# Altium schematic sheet ACH512识别升级仪V1.2_20260608.SchDoc
size A1; SheetNumber: 1; SheetTotal: 1
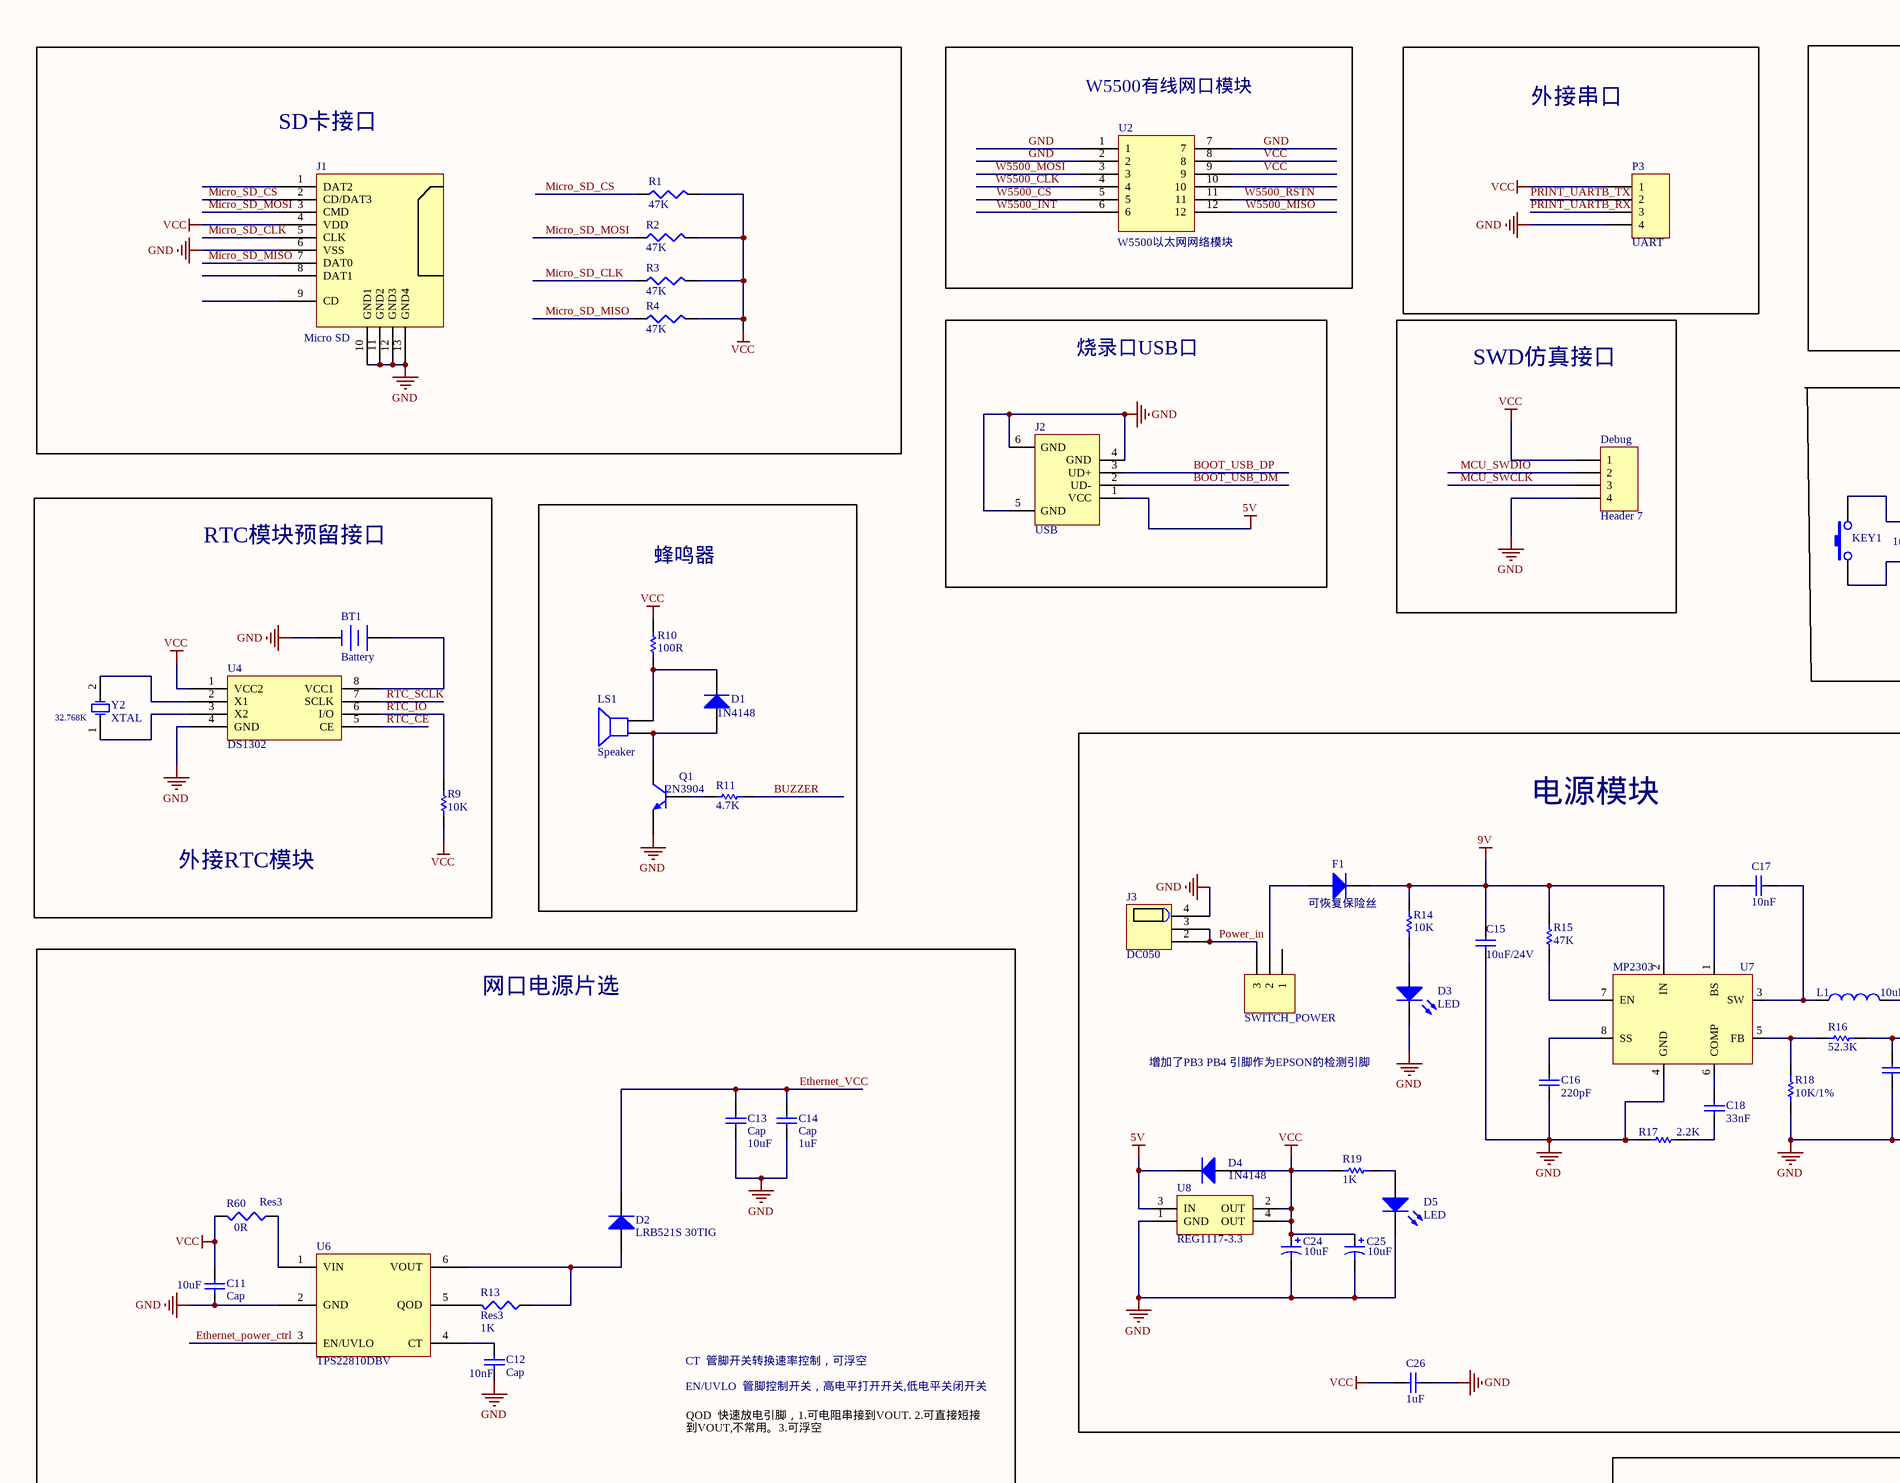
[diagram p0: ACH512识别升级仪V1.2_20260608.SchDoc, top left]
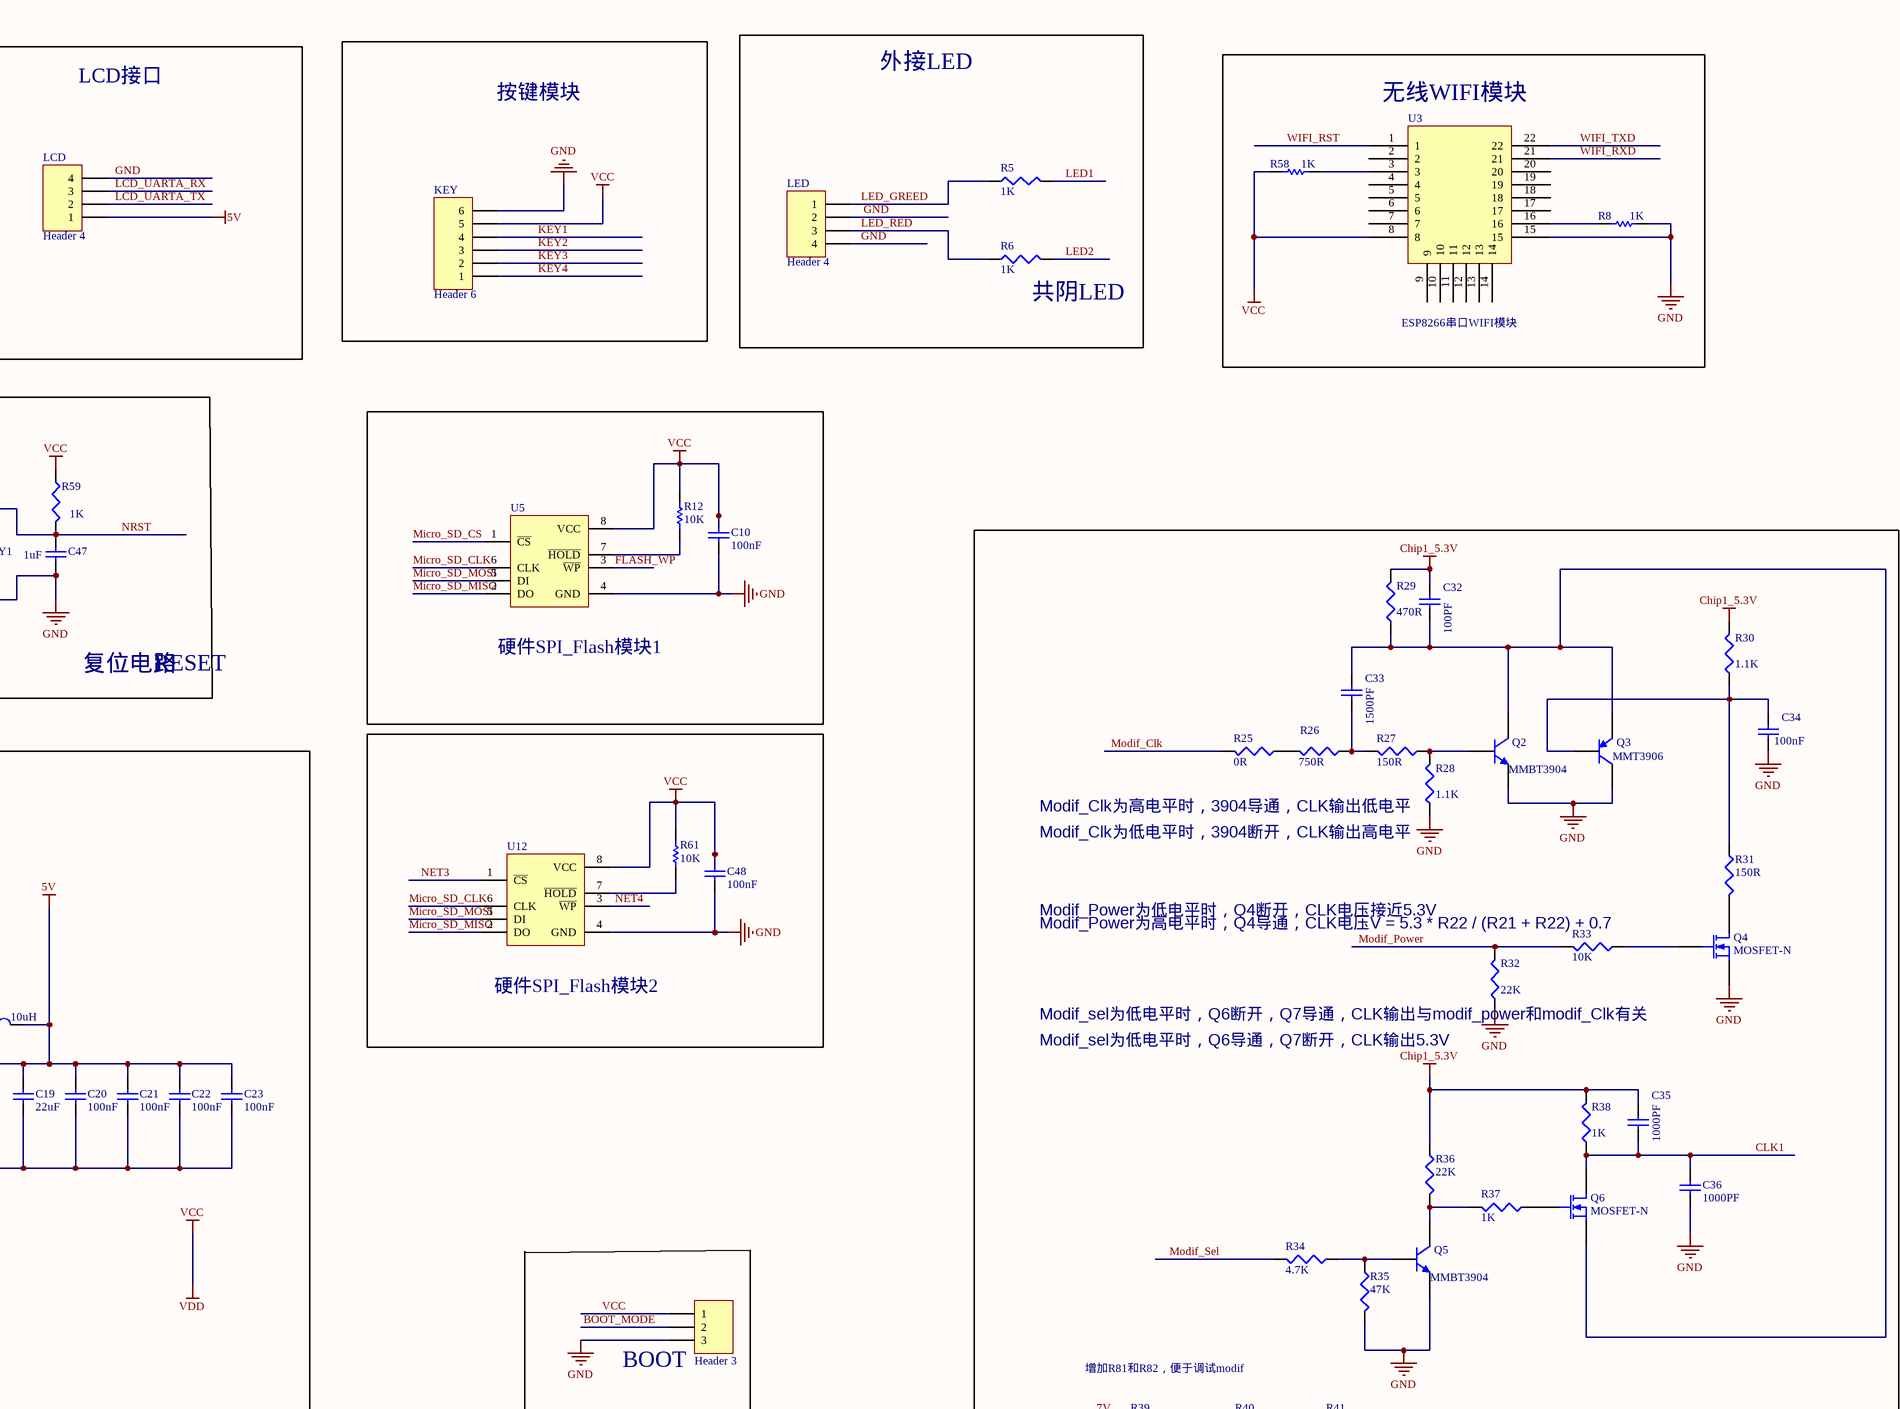
[diagram p1: ACH512识别升级仪V1.2_20260608.SchDoc, top right]
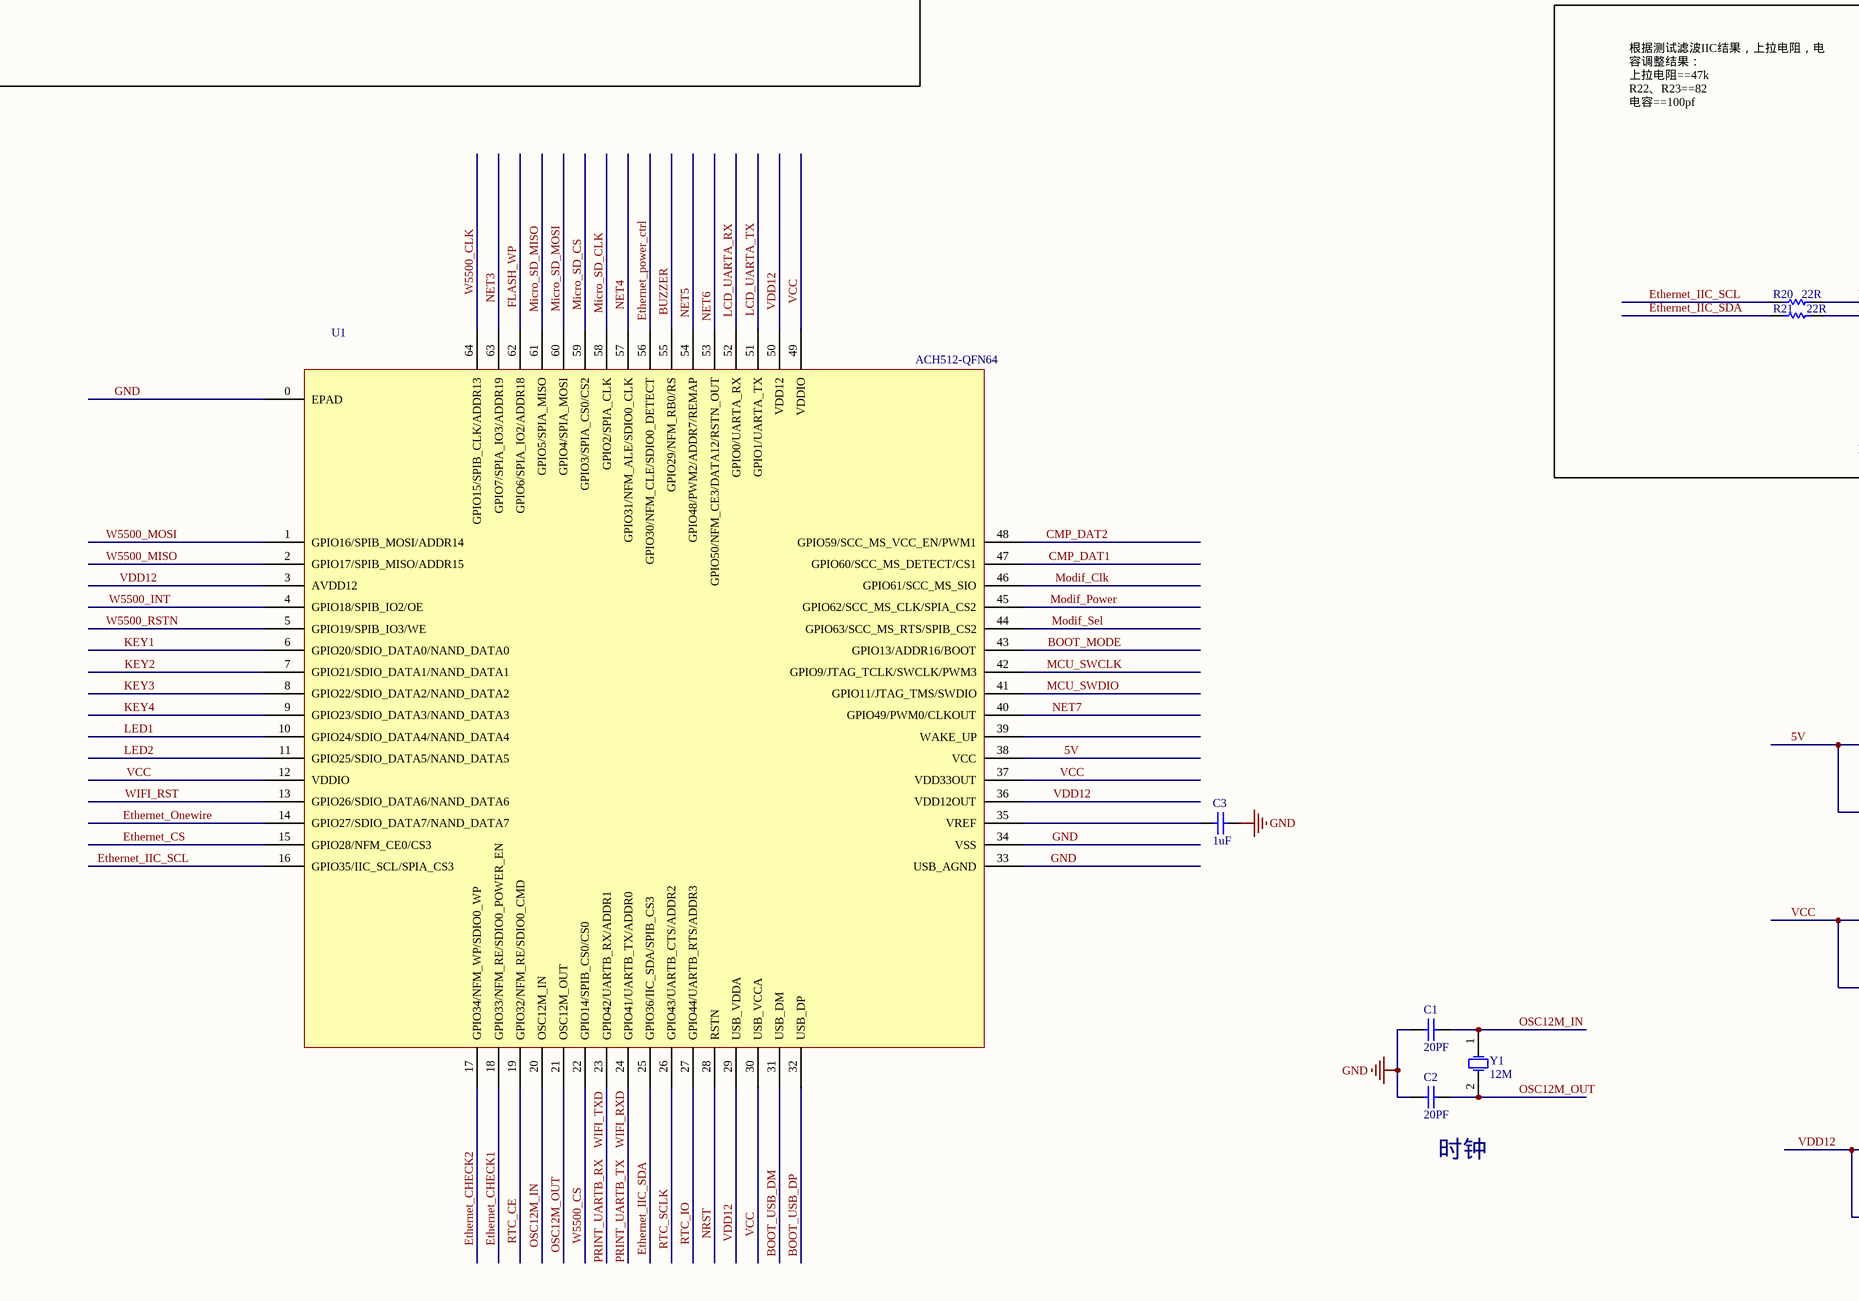
[diagram p2: ACH512识别升级仪V1.2_20260608.SchDoc, bottom left]
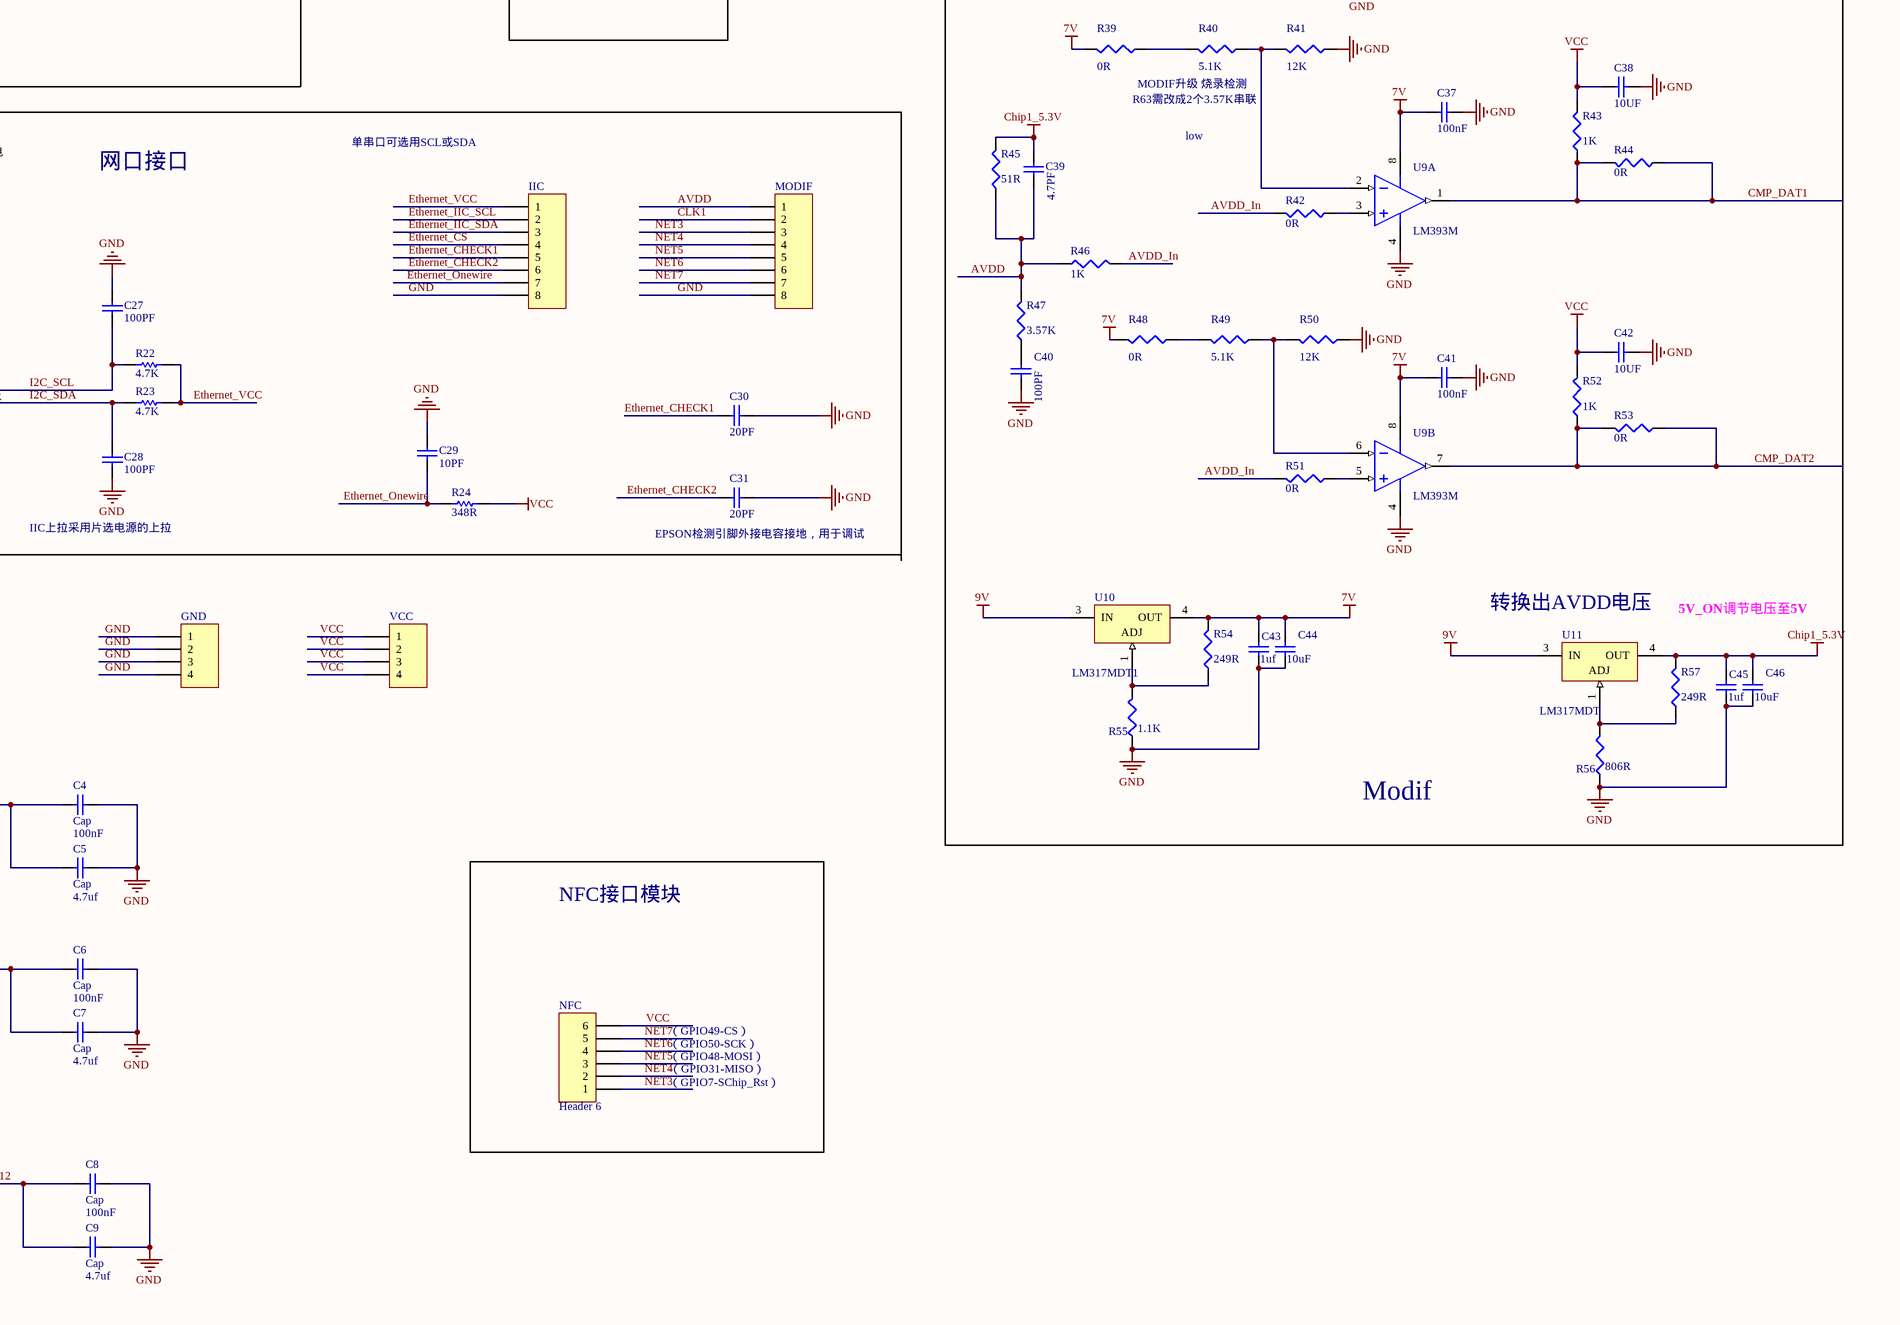
[diagram p3: ACH512识别升级仪V1.2_20260608.SchDoc, bottom right]

## Parts
Boot_sel  Header 3  [拨码开关]
BT1  Battery  [BAT600]
C1  value 20PF  [0603]  (hidden comment: Cap Semi)
C2  value 20PF  [0603]  (hidden comment: Cap Semi)
C3  value 1uF  [0603]  (hidden comment: Cap Semi)
C4  Cap  value 100nF  [0603]
C5  Cap  value 4.7uf  [0603]
C6  Cap  value 100nF  [0603]
C7  Cap  value 4.7uf  [0603]
C8  Cap  value 100nF  [0603]
C9  Cap  value 4.7uf  [0603]
C10  value 100nF  [0603]  (hidden comment: Cap Semi)
C11  Cap  value 10uF  [0603]
C12  Cap  value 10nF  [0603]
C13  Cap  value 10uF  [0603]
C14  Cap  value 1uF  [0603]
C15  value 10uF/24V  [0805]  (hidden comment: Cap Semi)
C16  value 220pF  [0603]  (hidden comment: Cap Semi)
C17  value 10nF  [0603]  (hidden comment: Cap Semi)
C18  value 33nF  [0603]  (hidden comment: Cap Semi)
C19  22uF  [0805]
C20  100nF  [0603]
C21  100nF  [0603]
C22  100nF  [0603]
C23  100nF  [0603]
C24  value 10uF  [0603]  (hidden comment: Cap Pol1)
C25  value 10uF  [0603]  (hidden comment: Cap Pol1)
C26  value 1uF  [0603]  (hidden comment: Cap Semi)
C27  value 100PF  [0603]  (hidden comment: Cap Semi)
C28  value 100PF  [0603]  (hidden comment: Cap Semi)
C29  value 10PF  [0603]  (hidden comment: Cap Semi)
C30  value 20PF  [0603]  (hidden comment: Cap Semi)
C31  value 20PF  [0603]  (hidden comment: Cap Semi)
C32  value 100PF  [0603]  (hidden comment: Cap Semi)
C33  value 1500PF  [0603]  (hidden comment: Cap Semi)
C34  value 100nF  [0603]  (hidden comment: Cap Semi)
C35  value 1000PF  [0603]  (hidden comment: Cap Semi)
C36  value 1000PF  [0603]  (hidden comment: Cap Semi)
C37  value 100nF  [0603]  (hidden comment: Cap Semi)
C38  value 10UF  [0603]  (hidden comment: Cap Semi)
C39  value 4.7PF  [0603]  (hidden comment: Cap Semi)
C40  value 100PF  [0603]  (hidden comment: Cap Semi)
C41  value 100nF  [0603]  (hidden comment: Cap Semi)
C42  value 10UF  [0603]  (hidden comment: Cap Semi)
C43  value 1uf  [0603]  (hidden comment: Cap Semi)
C44  value 10uF  [0603]  (hidden comment: Cap Semi)
C45  value 1uf  [0603]  (hidden comment: Cap Semi)
C46  value 10uF  [0603]  (hidden comment: Cap Semi)
C47  value 1uF  [0603]  (hidden comment: Cap Semi)
C48  value 100nF  [0603]  (hidden comment: Cap Semi)
D1  1N4148  [3216[1206]]
D2  LRB521S 30TIG  [0603]
D3  LED  [0603]
D4  1N4148  [3216[1206]]
D5  LED  [0603]
Debug  Header 7  [4PIN_贴片]
F1  可恢复保险丝  [FUSE_1812]
GND  (no value)  [4Pin_贴片]
IIC  (no value)  [RJ45网络插座]
J1  Micro SD  [MICRO_SD]
J2  USB  [USB_B_型贴片]
J3  DC050  [DC050_贴片]
KEY  Header 6  [6pin__1.25mm]
KEY1  SW-PB按键  [12*12_贴片按钮]  (value not drawn)
L1  value 10uH  [SMTDR75-100M]  (hidden comment: Inductor)
LCD  Header 4  [4pin_1.25mm]
LED  Header 4  [4pin_1.25mm]
LS1  Speaker  [贴片蜂鸣器]
MODIF  (no value)  [RJ45网络插座]
NFC  Header 6  [6pin__1.25mm]
P3  UART  [4Pin_贴片]
Q1  2N3904  [SOT23_N]
Q2  MMBT3904  [SOT23_N]
Q3  MMT3906  [SOT23_N]
Q4  MOSFET-N  [SOT23_N]
Q5  MMBT3904  [SOT23_N]
Q6  MOSFET-N  [SOT23_N]
R1  value 47K  [0603]  (hidden comment: Res3)
R2  value 47K  [0603]  (hidden comment: Res3)
R3  value 47K  [0603]  (hidden comment: Res3)
R4  value 47K  [0603]  (hidden comment: Res3)
R5  value 1K  [0603]  (hidden comment: Res3)
R6  value 1K  [0603]  (hidden comment: Res3)
R8  value 1K  [0603]  (hidden comment: Res1)
R9  value 10K  [0603]  (hidden comment: Res1)
R10  value 100R  [0603]  (hidden comment: Res1)
R11  value 4.7K  [0603]  (hidden comment: Res1)
R12  value 10K  [0603]  (hidden comment: Res1)
R13  Res3  value 1K  [0603]
R14  value 10K  [0603]  (hidden comment: Res1)
R15  value 47K  [0603]  (hidden comment: Res1)
R16  value 52.3K  [0603]  (hidden comment: Res1)
R17  value 2.2K  [0603]  (hidden comment: Res1)
R18  value 10K/1%  [0603]  (hidden comment: Res1)
R19  value 1K  [0603]  (hidden comment: Res1)
R20  value 22R  [0603]  (hidden comment: Res1)
R21  value 22R  [0603]  (hidden comment: Res1)
R22  value 4.7K  [0603]  (hidden comment: Res1)
R23  value 4.7K  [0603]  (hidden comment: Res1)
R24  value 348R  [0603]  (hidden comment: Res1)
R25  value 0R  [0603]  (hidden comment: Res3)
R26  value 750R  [0603]  (hidden comment: Res3)
R27  value 150R  [0603]  (hidden comment: Res3)
R28  value 1.1K  [0603]  (hidden comment: Res3)
R29  value 470R  [0603]  (hidden comment: Res3)
R30  value 1.1K  [0603]  (hidden comment: Res3)
R31  value 150R  [0603]  (hidden comment: Res3)
R32  value 22K  [0603]  (hidden comment: Res3)
R33  value 10K  [0603]  (hidden comment: Res3)
R34  value 4.7K  [0603]  (hidden comment: Res3)
R35  value 47K  [0603]  (hidden comment: Res3)
R36  value 22K  [0603]  (hidden comment: Res3)
R37  value 1K  [0603]  (hidden comment: Res3)
R38  value 1K  [0603]  (hidden comment: Res3)
R39  value 0R  [0603]  (hidden comment: Res3)
R40  value 5.1K  [0603]  (hidden comment: Res3)
R41  value 12K  [0603]  (hidden comment: Res3)
R42  value 0R  [0603]  (hidden comment: Res3)
R43  value 1K  [0603]  (hidden comment: Res3)
R44  value 0R  [0603]  (hidden comment: Res3)
R45  value 51R  [0603]  (hidden comment: Res3)
R46  value 1K  [0603]  (hidden comment: Res3)
R47  value 3.57K  [0603]  (hidden comment: Res3)
R48  value 0R  [0603]  (hidden comment: Res3)
R49  value 5.1K  [0603]  (hidden comment: Res3)
R50  value 12K  [0603]  (hidden comment: Res3)
R51  value 0R  [0603]  (hidden comment: Res3)
R52  value 1K  [0603]  (hidden comment: Res3)
R53  value 0R  [0603]  (hidden comment: Res3)
R54  value 249R  [0603]
R55  value 1.1K  [0603]
R56  value 806R  [0603]
R57  value 249R  [0603]
R58  value 1K  [0603]  (hidden comment: Res1)
R59  value 1K  [0603]  (hidden comment: Res3)
R60  Res3  value 0R  [0603]
R61  value 10K  [0603]  (hidden comment: Res1)
SWITCH_POWER  Header 3  [拨码开关]  (value not drawn)
U1  ACH512-QFN64  [QFN64]
U2  W5500以太网网络模块  [W5500以太网网络模块]
U3  ESP8266串口WIFI模块  [ESP8266串口WIFI模块]
U4  DS1302  [M08A_N]
U5  硬件SPI_Flash模块1  [W25Q128FV_SOIC8_208mil_S]
U6  TPS22810DBV  [SOT23-6]
U7  MP2303  [MP1482-SOIC8]
U8  REG1117-3.3  [ZZ311]
U9  LM393M  [M08A_N]  (parts A,B of 2)
U10  LM317MDT1  [369A-13]
U11  LM317MDT  [369A-13]
U12  硬件SPI_Flash模块2  [W25Q128FV_SOIC8_208mil_S]
VCC  (no value)  [4Pin_贴片]
Y1  12M  [SM-49]
Y2  XTAL  [32K贴片晶振]

## Blocks framed on the sheet
SD卡接口: J1 R1-R4
W5500有线网口模块: U2
外接串口: P3
LCD接口: LCD
按键模块: KEY
无线WIFI模块: R8 R58 U3
烧录口USB口: J2
SWD仿真接口: Debug
蜂鸣器: D1 LS1 Q1 R10 R11
Modif: C32-C46 Q2-Q6 R25-R57 U9-U11
电源模块: C15-C26 D3-D5 F1 J3 L1 R14-R19 SWITCH_POWER U7 U8
网口电源片选: C11-C14 D2 R13 R60 U6
BOOT: Boot_sel
NFC接口模块: NFC

## Nets
5V: C4.2 C5.2 C19.1 C20.1 C21.1 C22.1 C23.1 D4.2(K) J2.1(VCC) L1.2 LCD.1 R16.1 U1.38(VCC) U8.3(IN)
7V: C37.1 C41.1 C43.1 C44.1 R39.2 R48.2 R54.2 U9.8(V+) U10.4(OUT)
9V: C15.1 F1.2(K) R14.2 R15.2 U7.2(IN) U10.3(IN) U11.3(IN)
Chip1_5.3V: C32.2 C35.2 C39.2 C45.1 C46.1 R29.2 R30.2 R36.1 R38.2 R45.2 R57.2 U11.4(OUT)
GND: Boot_sel.3 BT1.2(-) C1.2 C2.2 C3.2 C4.1 C5.1 C6.1 C7.1 C8.1 C9.1 C10.1 C11.2 C12.2 C13.2 C14.2 C15.2 C16.2 C19.2 C20.2 C21.2 C22.2 C23.2 C24.2 C25.2 C26.2 C27.1 C28.2 C29.1 C30.2 C31.2 C34.1 C36.2 C37.2 C38.1 C40.1 C41.2 C42.1 C43.2 C44.2 C45.2 C46.2 C47.2 C48.1 D3.2(K) D5.2(K) Debug.4 GND.1 GND.2 GND.3 GND.4 IIC.8 J1.6(VSS) J1.10(GND1) J1.11(GND2) J1.12(GND3) J1.13(GND4) J2.4(GND) J2.5(GND) J2.6(GND) J3.4 KEY.6 KEY1.2 LCD.4 LED.2 LED.4 MODIF.8 P3.4 Q1.1(E) Q2.2(E) Q3.2(E) Q4.3(S) Q5.2(E) R8.1 R17.1 R18.2 R28.1 R32.1 R35.2 R41.1 R50.1 R55.1 R56.1 U1.0(EPAD) U1.33(USB_AGND) U1.34(VSS) U2.1 U2.2 U2.7 U3.15 U4.4(GND) U5.4(GND) U6.2(GND) U7.4(GND) U8.1(GND) U9.4(GND) U12.4(GND)
VCC: Boot_sel.1 C6.2 C7.2 C10.2 C11.1 C24.1 C25.1 C26.1 C38.2 C42.2 C48.2 D4.1(A) Debug.1 J1.4(VDD) KEY.5 NFC.6 P3.1 R1.2 R2.2 R3.2 R4.2 R9.2 R10.2 R12.1 R19.2 R24.2 R43.2 R52.2 R58.2 R59.1 R60.2 R61.1 U1.12(VDDIO) U1.30(USB_VCCA) U1.37(VDD33OUT) U1.49(VDDIO) U2.8 U2.9 U3.8 U4.1(VCC2) U5.8(VCC) U8.2(OUT) U8.4(OUT) U12.8(VCC) VCC.1 VCC.2 VCC.3 VCC.4  [also labelled VDD]
AVDD: C39.1 MODIF.1 R45.1 R46.1 R47.2
AVDD_In: R42.2 R46.2 R51.2
BOOT_MODE: Boot_sel.2 U1.43(GPIO13/ADDR16/BOOT)
BOOT_USB_DM: J2.2(UD-) U1.31(USB_DM)
BOOT_USB_DP: J2.3(UD+) U1.32(USB_DP)
BUZZER: R11.1 U1.55(GPIO29/NFM_RB0/RS)
CLK1: C35.1 C36.1 MODIF.2 Q6.1(D) R38.1
CMP_DAT1: R43.1 R44.1 R44.2 U1.47(GPIO60/SCC_MS_DETECT/CS1) U9.1(OUT)
CMP_DAT2: R52.1 R53.1 R53.2 U1.48(GPIO59/SCC_MS_VCC_EN/PWM1) U9.7(OUT)
Ethernet_CHECK1: C30.1 IIC.5 U1.18(GPIO33/NFM_RE/SDIO0_POWER_EN)
Ethernet_CHECK2: C31.1 IIC.6 U1.17(GPIO34/NFM_WP/SDIO0_WP)
Ethernet_CS: IIC.4 U1.15(GPIO28/NFM_CE0/CS3)
Ethernet_IIC_SCL: IIC.2 R20.2 U1.16(GPIO35/IIC_SCL/SPIA_CS3)
Ethernet_IIC_SDA: IIC.3 R21.2 U1.25(GPIO36/IIC_SDA/SPIB_CS3)
Ethernet_Onewire: C29.2 IIC.7 R24.1 U1.14(GPIO27/SDIO_DATA7/NAND_DATA7)
Ethernet_power_ctrl: U1.56(GPIO30/NFM_CLE/SDIO0_DETECT) U6.3(EN/UVLO)
Ethernet_VCC: C13.1 C14.1 D2.2(K) IIC.1 R22.2 R23.1
FLASH_WP: U1.62(GPIO6/SPIA_IO2/ADDR18) U5.3(~{WP})
I2C_SCL: C27.2 R20.1 R22.1
I2C_SDA: C28.1 R21.1 R23.2
KEY1: KEY.4 U1.6(GPIO20/SDIO_DATA0/NAND_DATA0)
KEY2: KEY.3 U1.7(GPIO21/SDIO_DATA1/NAND_DATA1)
KEY3: KEY.2 U1.8(GPIO22/SDIO_DATA2/NAND_DATA2)
KEY4: KEY.1 U1.9(GPIO23/SDIO_DATA3/NAND_DATA3)
LCD_UARTA_RX: LCD.3 U1.52(GPIO0/UARTA_RX)
LCD_UARTA_TX: LCD.2 U1.51(GPIO1/UARTA_TX)
LED1: R5.1 U1.10(GPIO24/SDIO_DATA4/NAND_DATA4)
LED2: R6.1 U1.11(GPIO25/SDIO_DATA5/NAND_DATA5)
LED_GREED: LED.1 R5.2
LED_RED: LED.3 R6.2
MCU_SWCLK: Debug.3 U1.42(GPIO9/JTAG_TCLK/SWCLK/PWM3)
MCU_SWDIO: Debug.2 U1.41(GPIO11/JTAG_TMS/SWDIO)
Micro_SD_CLK: J1.5(CLK) R3.1 U1.58(GPIO2/SPIA_CLK) U5.6(CLK) U12.6(CLK)
Micro_SD_CS: J1.2(CD/DAT3) R1.1 U1.59(GPIO3/SPIA_CS0/CS2) U5.1(~{CS})
Micro_SD_MISO: J1.7(DAT0) R4.1 U1.61(GPIO5/SPIA_MISO) U5.2(DO) U12.2(DO)
Micro_SD_MOSI: J1.3(CMD) R2.1 U1.60(GPIO4/SPIA_MOSI) U5.5(DI) U12.5(DI)
Modif_Clk: R25.2 U1.46(GPIO61/SCC_MS_SIO)
Modif_Power: R32.2 R33.2 U1.45(GPIO62/SCC_MS_CLK/SPIA_CS2)
Modif_Sel: R34.2 U1.44(GPIO63/SCC_MS_RTS/SPIB_CS2)
NET3: MODIF.3 NFC.1 U1.63(GPIO7/SPIA_IO3/ADDR19) U12.1(~{CS})
NET4: MODIF.4 NFC.2 U1.57(GPIO31/NFM_ALE/SDIO0_CLK) U12.3(~{WP})
NET5: MODIF.5 NFC.3 U1.54(GPIO48/PWM2/ADDR7/REMAP)
NET6: MODIF.6 NFC.4 U1.53(GPIO50/NFM_CE3/DATA12/RSTN_OUT)
NET7: MODIF.7 NFC.5 U1.40(GPIO49/PWM0/CLKOUT)
NRST: C47.1 KEY1.1 R59.2 U1.28(RSTN)
OSC12M_IN: C1.1 U1.20(OSC12M_IN) Y1.1(OSC1)
OSC12M_OUT: C2.1 U1.21(OSC12M_OUT) Y1.2(OSC2)
Power_in: J3.2 J3.3 SWITCH_POWER.3
PRINT_UARTB_RX: P3.3 U1.23(GPIO42/UARTB_RX/ADDR1) U3.22  [also labelled WIFI_TXD]
PRINT_UARTB_TX: P3.2 U1.24(GPIO41/UARTB_TX/ADDR0) U3.21  [also labelled WIFI_RXD]
RTC_CE: U1.19(GPIO32/NFM_RE/SDIO0_CMD) U4.5(CE)
RTC_IO: R9.1 U1.27(GPIO44/UARTB_RTS/ADDR3) U4.6(I/O)
RTC_SCLK: U1.26(GPIO43/UARTB_CTS/ADDR2) U4.7(SCLK)
VDD12: C8.2 C9.2 U1.3(AVDD12) U1.29(USB_VDDA) U1.36(VDD12OUT) U1.50(VDD12)
W5500_CLK: U1.64(GPIO15/SPIB_CLK/ADDR13) U2.4
W5500_CS: U1.22(GPIO14/SPIB_CS0/CS0) U2.5
W5500_INT: U1.4(GPIO18/SPIB_IO2/OE) U2.6
W5500_MISO: U1.2(GPIO17/SPIB_MISO/ADDR15) U2.12
W5500_MOSI: U1.1(GPIO16/SPIB_MOSI/ADDR14) U2.3
W5500_RSTN: U1.5(GPIO19/SPIB_IO3/WE) U2.11
WIFI_RST: U1.13(GPIO26/SDIO_DATA6/NAND_DATA6) U3.1
NetBT1_1: BT1.1(+) U4.8(VCC1)
NetC3_1: C3.1 U1.35(VREF)
NetC12_1: C12.1 U6.4(CT)
NetC16_1: C16.1 U7.8(SS)
NetC17_1: C17.1 U7.1(BS)
NetC17_2: C17.2 L1.1 U7.3(SW)
NetC18_1: C18.1 U7.6(COMP)
NetC18_2: C18.2 R17.2
NetC32_1: C32.1 C33.2 Q2.3(C) Q3.3(C) Q6.3(S) R29.1
NetC33_1: C33.1 R26.1 R27.2
NetC34_2: C34.2 Q3.1(B) R30.1 R31.1
NetC40_2: C40.2 R47.1
NetD1_1: D1.1(A) LS1.1 Q1.3(C)
NetD1_2: D1.2(K) LS1.2 R10.1
NetD2_1: D2.1(A) R13.1 U6.6(VOUT)
NetD3_1: D3.1(A) R14.1
NetD5_1: D5.1(A) R19.1
NetF1_1: F1.1(A) SWITCH_POWER.2
NetQ1_2: Q1.2(B) R11.2
NetQ2_1: Q2.1(B) R27.1 R28.2
NetQ4_1: Q4.1(D) R31.2
NetQ4_2: Q4.2(G) R33.1
NetQ5_1: Q5.1(B) R34.1 R35.1
NetQ5_3: Q5.3(C) R36.2 R37.2
NetQ6_2: Q6.2(G) R37.1
NetR8_2: R8.2 U3.16
NetR12_2: R12.2 U5.7(~{HOLD})
NetR13_2: R13.2 U6.5(QOD)
NetR15_1: R15.1 U7.7(EN)
NetR16_2: R16.2 R18.1 U7.5(FB)
NetR25_1: R25.1 R26.2
NetR39_1: R39.1 R40.2
NetR40_1: R40.1 R41.2 U9.2(IN-)
NetR42_1: R42.1 U9.3(IN+)
NetR48_1: R48.1 R49.2
NetR49_1: R49.1 R50.2 U9.6(IN-)
NetR51_1: R51.1 U9.5(IN+)
NetR54_1: R54.1 R55.2 U10.1(ADJ)
NetR56_2: R56.2 R57.1 U11.1(ADJ)
NetR58_1: R58.1 U3.3
NetR60_1: R60.1 U6.1(VIN)
NetR61_2: R61.2 U12.7(~{HOLD})
NetU4_2: U4.2(X1) Y2.2(OSC2)
NetU4_3: U4.3(X2) Y2.1(OSC1)

Not connected (* = marked no-connect by the designer): J1 1(DAT2) 8(DAT1) 9(CD); SWITCH_POWER 1; U1 39(WAKE_UP); U2 10; U3 2 4 5 6 7 9 10 11 12 13 14 17 18 19 20

## Notes on the sheet
- 外接LED
- (near R6) 共阴LED
- RTC模块预留接口
- 复位电路
- RESET
- (near Y2) 32.768K
- Modif_Clk为高电平时，3904导通，CLK输出低电平
- Modif_Clk为低电平时，3904断开，CLK输出高电平
- 外接RTC模块
- Modif_Power为低电平时，Q4断开，CLK电压接近5.3V
- (near R32) Modif_Power为高电平时，Q4导通，CLK电压V = 5.3 * R22 / (R21 + R22) + 0.7
- (near R32) Modif_sel为低电平时，Q6断开，Q7导通，CLK输出与modif_power和modif_Clk有关
- Modif_sel为低电平时，Q6导通，Q7断开，CLK输出5.3V
- 增加了PB3 PB4 引脚作为EPSON的检测引脚
- CT  管脚开关转换速率控制，可浮空
- 增加R81和R82，便于调试modif
- EN/UVLO  管脚控制开关，高电平打开开关,低电平关闭开关
- MODIF升级 烧录检测
- QOD  快速放电引脚，1.可电阻串接到VOUT. 2.可直接短接到VOUT,不常用。3.可浮空
- 单串口可选用SCL或SDA
- R63需改成2个3.57K串联
- low
- 网口接口
- 根据测试滤波IIC结果，上拉电阻，电容调整结果：
  上拉电阻==47k
  R22、R23==82
  电容==100pf
- IIC上拉采用片选电源的上拉
- (near C31) EPSON检测引脚外接电容接地，用于调试
- (near U11) 转换出AVDD电压
- 5V_ON调节电压至5V
- （GPIO49-CS）
- （GPIO50-SCK）
- （GPIO7-SChip_Rst）
- （GPIO48-MOSI）
- （GPIO31-MISO）
- (near C2) 时钟

## Library data of the parts
Boot_sel SWITCH_POWER = Header 3: Header, 3-Pin; LatestRevisionDate: 17-Jul-2002; LatestRevisionNote: Re-released for DXP Platform.; Publisher: Altium Limited
BT1 = Battery: Multicell Battery; Published: 24-Mar-1999; LatestRevisionDate: 17-Jul-2002; LatestRevisionNote: Re-released for DXP Platform.; PackageReference: BAT-2; Publisher: Altium Limited; PackageDescription: Battery; 2 Leads
C1-C3 C10 C15-C23 C26-C48 = Cap Semi: Capacitor (Semiconductor SIM Model); Published: 8-Jun-2000; PackageReference: C1206; Publisher: Altium Limited
  C1-C3 C10 C26-C31 C47 C48: LatestRevisionDate: 29-May-2009; LatestRevisionNote: IPC-7351 Footprint Added.; PackageDescription: Chip Capacitor
  C15-C18 C32-C46: LatestRevisionDate: 17-Jul-2002; LatestRevisionNote: Re-released for DXP Platform.
  C19: LatestRevisionDate: 17-Jul-2002; LatestRevisionNote: Re-released for DXP Platform.; Value: 22uF
  C20-C23: LatestRevisionDate: 17-Jul-2002; LatestRevisionNote: Re-released for DXP Platform.; Value: 100nF
C4-C9 C11-C14 = Cap: Capacitor; Published: 8-Jun-2000; LatestRevisionDate: 17-Jul-2002; LatestRevisionNote: Re-released for DXP Platform.; PackageReference: RAD-0.3; Publisher: Altium Limited
C24 C25 = Cap Pol1: Polarized Capacitor (Radial); Published: 8-Jun-2000; LatestRevisionDate: 17-Jul-2002; LatestRevisionNote: Re-released for DXP Platform.; PackageReference: RB7.6-15; Publisher: Altium Limited; PackageDescription: Polarized Capacitor (Radial); 2 Leads
D1 = Diode 1N4148: High Conductance Fast Diode; Published: 8-Jun-2000; LatestRevisionDate: 17-Jul-2002; LatestRevisionNote: Re-released for DXP Platform.; DatasheetVersion: 1997; PackageReference: DO-35; Publisher: Altium Limited; Code_JEDEC: DO-204-AH; ComponentLink1Description: Manufacturer Link; ComponentLink1URL: http://www.fairchildsemi.com/; ComponentLink2Description: Datasheet; ComponentLink2URL: http://www.fairchildsemi.com/ds/1N%2F1N4148.pdf
D2 = Diode: Default Diode; Published: 8-Jun-2000; LatestRevisionDate: 17-Jul-2002; LatestRevisionNote: Re-released for DXP Platform.; PackageDocument: Sep-1996; PackageReference: SMC; Publisher: Altium Limited; Code_JEDEC: DO-214-AB
D3 D5 = LED1: Typical RED GaAs LED; Published: 8-Jun-2000; LatestRevisionDate: 08-Jul-2005; LatestRevisionNote: Mech Layer 1 removed.; PackageReference: LED-1; Publisher: Altium Limited; PackageDescription: LED; 2 Leads
D4 = 1N4148: High Conductance Fast Diode; Published: 8-Jun-2000; LatestRevisionDate: 17-Jul-2002; LatestRevisionNote: Re-released for DXP Platform.; DatasheetDocument: 1997; PackageReference: DO-35; Publisher: Altium Limited; Code_JEDEC: DO-204-AH; ComponentLink1Description: Manufacturer Link; ComponentLink1URL: http://www.fairchildsemi.com/; ComponentLink2Description: Datasheet; ComponentLink2URL: http://www.fairchildsemi.com/ds/1N%2F1N4148.pdf
Debug GND LCD LED P3 VCC = Header 4: Header, 4-Pin; LatestRevisionDate: 17-Jul-2002; LatestRevisionNote: Re-released for DXP Platform.; Publisher: Altium Limited
F1 = Diode 1N4007: 1 Amp General Purpose Rectifier; Published: 8-Jun-2000; LatestRevisionDate: 17-Jul-2002; LatestRevisionNote: Re-released for DXP Platform.; DatasheetVersion: 1998; PackageVersion: Aug-1999; PackageReference: DO-41; Publisher: Altium Limited; PackageDescription: Diode, Axial; Body 5.2 x 2.7 mm (LxDia. max), Lead Dia. 0.86 mm (max); Code_JEDEC: DO-204-AL; ComponentLink1Description: Manufacturer Link; ComponentLink1URL: http://www.fairchildsemi.com/; ComponentLink2Description: Datasheet; ComponentLink2URL: http://www.fairchildsemi.com/ds/1N%2F1N4001.pdf
IIC MODIF = Header 8: Header, 8-Pin; LatestRevisionDate: 17-Jul-2002; LatestRevisionNote: Re-released for DXP Platform.; Publisher: Altium Limited
J1 = MicroSD
KEY NFC = Header 6: Header, 6-Pin; LatestRevisionDate: 17-Jul-2002; LatestRevisionNote: Re-released for DXP Platform.; Publisher: Altium Limited
L1 = Inductor: Code_IEC: 1005; Published: 8-Jun-2000; LatestRevisionDate: 29-May-2009; LatestRevisionNote: IPC-7351 Footprint Added.; PackageReference: 0402-A; Publisher: Altium Limited; PackageDescription: Chip Inductor; Code_JEITA: 0402
LS1 = Speaker: Loudspeaker; Published: 24-Mar-1999; LatestRevisionDate: 17-Jul-2002; LatestRevisionNote: Re-released for DXP Platform.; PackageReference: PIN2; Publisher: Altium Limited
Q1 = 2N3904: NPN General Purpose Amplifier; pin to pad: 1>2 2>1; Published: 8-Jun-2000; LatestRevisionDate: 15-Jan-2003; LatestRevisionNote: PCB Footprint 'BCY-W3/D4.7' replaced; DatasheetVersion: 1997; PackageVersion: Sep-1998; PackageReference: TO-92A; Publisher: Altium Limited; Code_JEDEC: TO-92A; ComponentLink1Description: Manufacturer Link; ComponentLink1URL: http://www.fairchildsemi.com/; ComponentLink2Description: Datasheet; ComponentLink2URL: http://www.fairchildsemi.com/ds/2N%2F2N3904.pdf
Q2 Q5 = MMBT3904: NPN Switching Transistor; Published: 17-Sep-2003; LatestRevisionDate: 12-Dec-2006; LatestRevisionNote: IPC-7351 Footprint Added.; DatasheetVersion: 13-May-2002; PackageVersion: May-1999; PackageReference: SOT23; Publisher: Altium Limited; PackageDescription: 3-Pin SOT-23 Package 0.95 mm Pitch, 2.3 mm Lead Span; ComponentLink1Description: Manufacturer Link; ComponentLink1URL: http://www.semiconductors.philips.com/; ComponentLink2Description: Datasheet; ComponentLink2URL: http://www.semiconductors.philips.com/acrobat/datasheets/MMBT3904_4.pdf
Q3 = 9012
Q4 Q6 = MOSFET-N: N-Channel MOSFET; pin to pad: 1>3 2>1 3>2; PackageDocument: 1995/1996; Published: 8-Jun-2000; LatestRevisionDate: 17-Jul-2002; LatestRevisionNote: Re-released for DXP Platform.; PackageReference: E3; Publisher: Altium Limited
R1-R6 R13 R25-R57 R59 R60 = Res3: Resistor; Published: 8-Jun-2000; PackageReference: J1-0603; Publisher: Altium Limited
  R1-R6 R13 R59 R60: LatestRevisionDate: 29-May-2009; LatestRevisionNote: IPC-7351 Footprint Added.; PackageDescription: Chip Resistor
  R25-R57: LatestRevisionDate: 04-Mar-2005; LatestRevisionNote: PCB Footprint replaced.
R8-R12 R14-R24 R58 R61 = Res1: Resistor; Published: 8-Jun-2000; LatestRevisionDate: 17-Jul-2002; LatestRevisionNote: Re-released for DXP Platform.; PackageReference: AXIAL-0.3; Publisher: Altium Limited; PackageDescription: Axial Device, Thru-Hole; 2 Leads; 0.3 in Pin Spacing
U1 = Component_1
U2 = Component_7
U3 = Component_6
U5 U12 = W25QXX: SPI FLASH
U6 = Component_2
U8 = REG1117-3.3: 800mA and 1A Low Dropout Positive Regulator 2.85V, 3.3V, 5V, and Adjustable; Published: 8-Jun-2000; LatestRevisionDate: 17-Jul-2002; LatestRevisionNote: Re-released for DXP Platform.; DatasheetVersion: Sep-1997; PackageVersion: revC; PackageReference: ZZ311; Publisher: Altium Limited; PackageDescription: SOT-223/SC-73; 4 Leads; Body 6.7 x 7.3 mm, inc. leads (LxW max); ComponentLink1Description: Manufacturer Link; ComponentLink1URL: http://www.ti.com/; ComponentLink2Description: Datasheet; ComponentLink2URL: http://www-s.ti.com/sc/ds/REG1117.pdf
U9 = LM393M: Low-Power Low Offset Voltage Dual Comparator; Published: 15-Apr-2002; LatestRevisionDate: 13-Apr-2006; LatestRevisionNote: IPC-7351 Footprint Added.; DatasheetVersion: Oct-1999; PackageVersion: Sep-1997; PackageReference: M08A; Publisher: Altium Limited; PackageDescription: 8-Pin Small Outline Integrated Circuit 1.27 mm Pitch; Code_JEDEC: MS-012-AA; Code_IPC: SOIC127P600-8; ComponentLink1Description: Manufacturer Link; ComponentLink1URL: http://www.national.com/; ComponentLink2Description: Datasheet; ComponentLink2URL: http://www.national.com/ds.cgi/LM/LM193.pdf; ComponentLink3Description: URL Link1; ComponentLink3URL: http://www.national.com/pf/LM/LM393.html
U10 U11 = LM317MDT: Three-Terminal Adjustable Output Positive Voltage Regulator; Note: Pin 2 is electrically connected to Pin 4 (TAB); Pin 2 is trimmed and not drawn; Published: 15-Apr-2002; DatasheetVersion: Nov-1999; PackageVersion: 1997; PackageReference: 369A-13; Publisher: Altium Limited; PackageDescription: D-PAK/TO-252-AA; 3 Leads (1 Cropped); Body 10.3 (inc. leads) x 6.7 mm (LxW max); ComponentLink1Description: Manufacturer Link; ComponentLink1URL: http://www.onsemi.com/site/products/taxonomy/0,4438,503,00.html; ComponentLink2Description: Datasheet; ComponentLink2URL: http://www.onsemi.com/pub/Collateral/LM317M-D.PDF
Y1 Y2 = XTAL: Crystal Oscillator; Published: 8-Jun-2000; LatestRevisionDate: 17-Jul-2002; LatestRevisionNote: Re-released for DXP Platform.; PackageReference: R38; Publisher: Altium Limited; PackageDescription: Crystal, Thru-Hole; 2 Leads; Body 3.1 x 8.2 mm (Dia.xH)